# EAGLE design nabijecka (EAGLE 6.3)
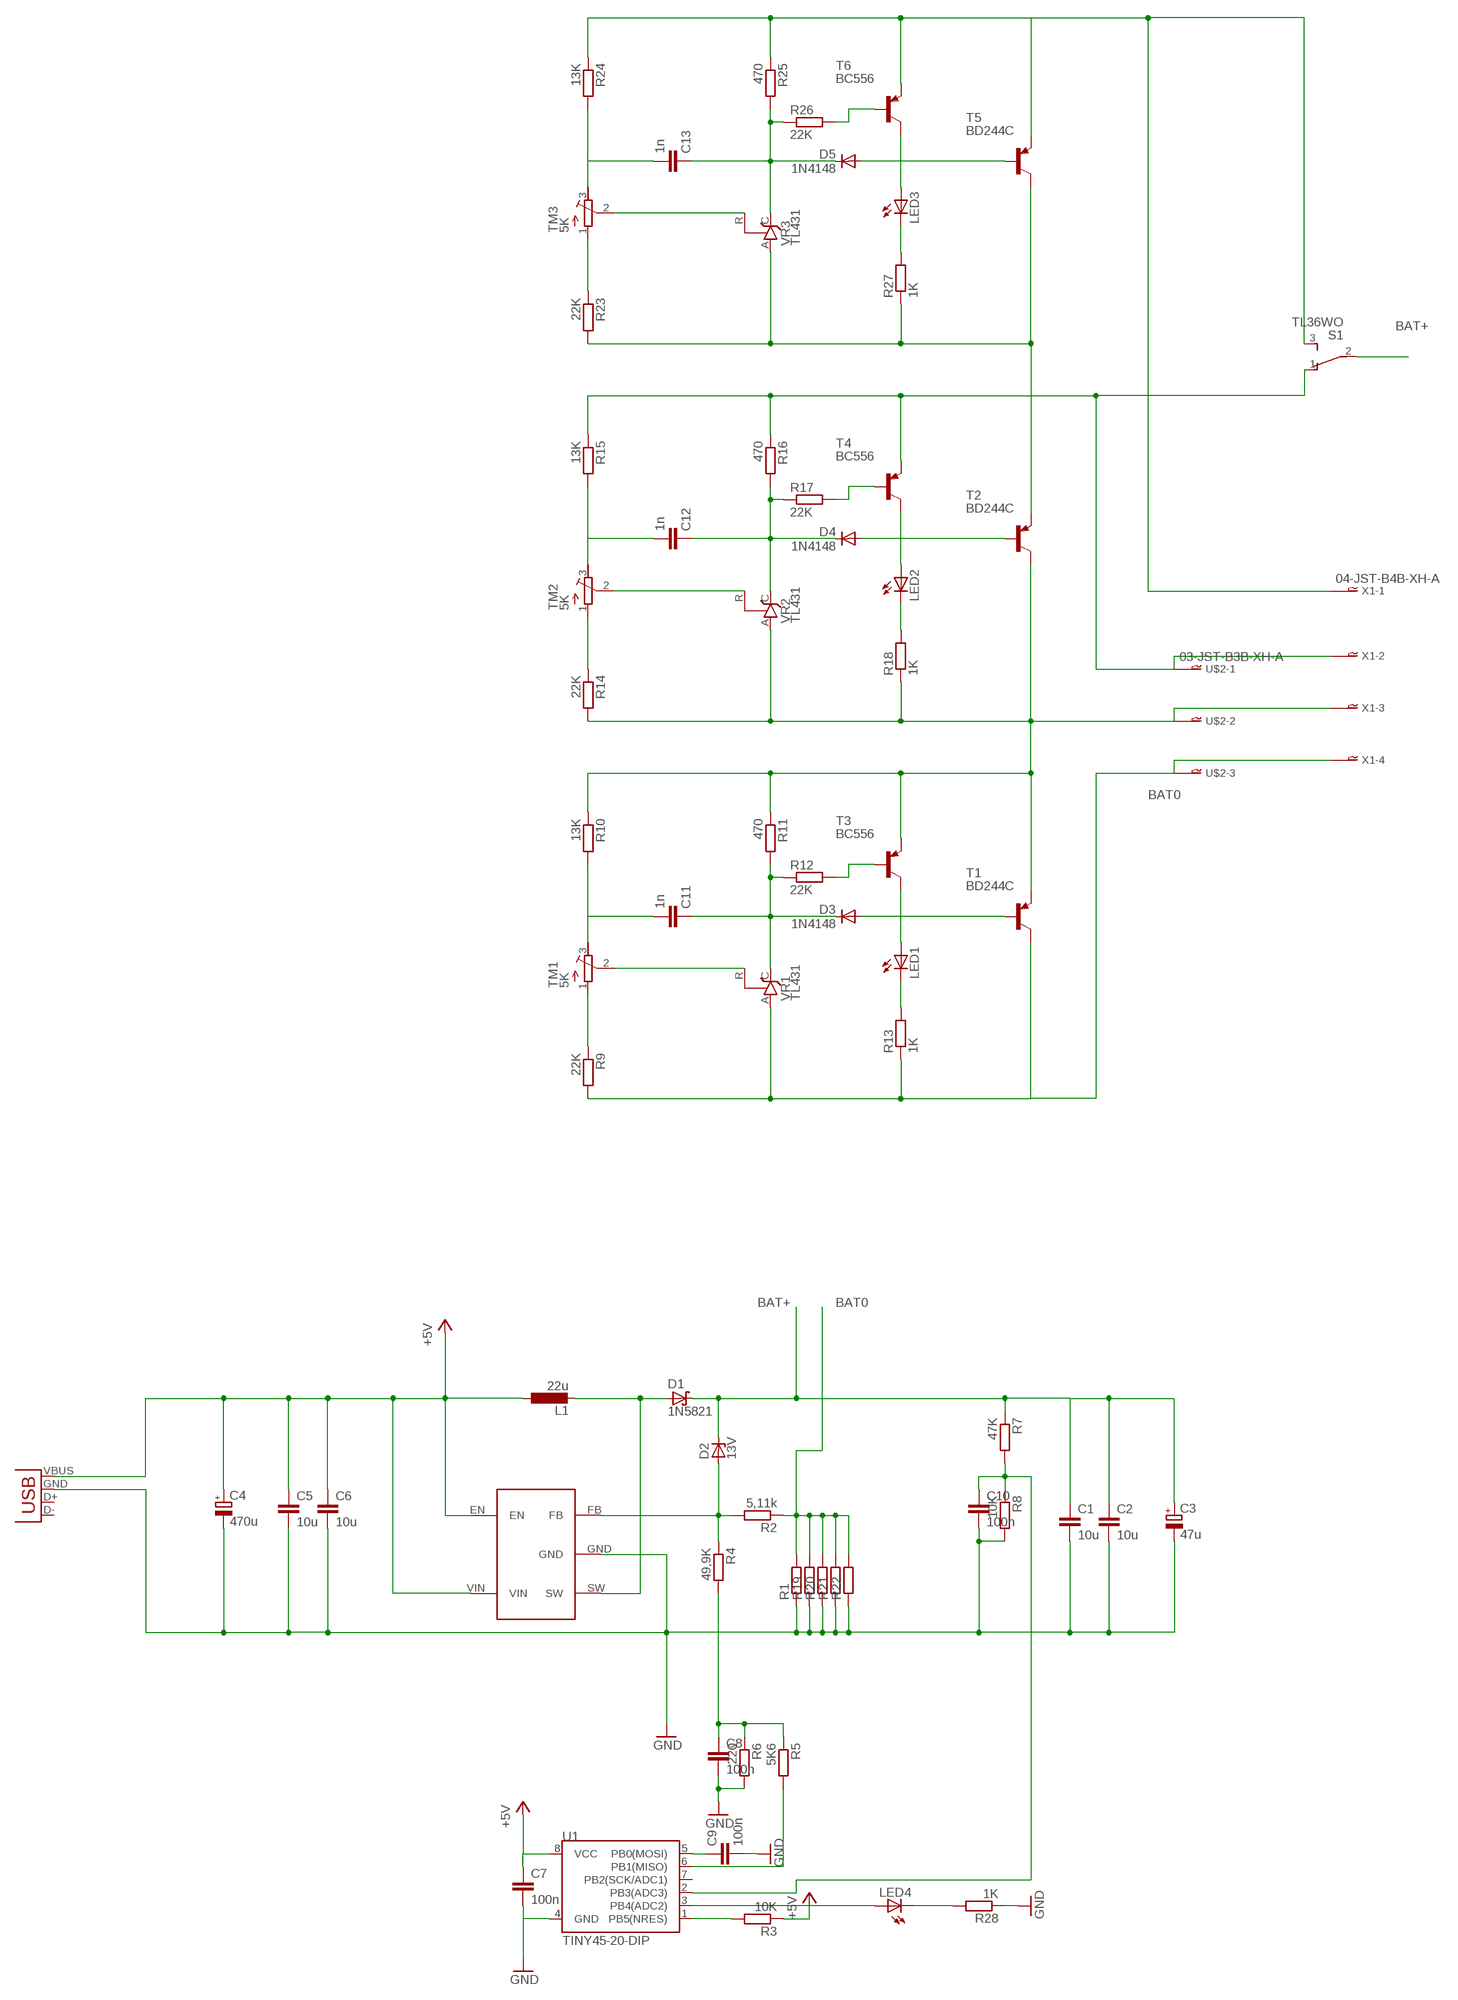
[diagram p0: schematic, sheet 1]

## Parts
C1  10u  C-EUC1206  [C1206]
C2  10u  C-EUC1206  [C1206]
C3  47u  CPOL-EUE3.5-8  [E3,5-8]
C4  470u  CPOL-EUE3.5-8  [E3,5-8]
C5  10u  C-EUC1206  [C1206]
C6  10u  C-EUC1206  [C1206]
C7  100n  C-EUC0805  [C0805]
C8  100n  C-EUC1206  [C1206]
C9  100n  C-EUC0805  [C0805]
C10  100n  C-EUC1206  [C1206]
C11  1n  C-EUC1206  [C1206]
C12  1n  C-EUC1206  [C1206]
C13  1n  C-EUC1206  [C1206]
D1  1N5821  SCHOTTKY-DIODEDO35-7  [DO35-7]
D2  13V  ZENER-DIODESOD80C  [SOD80C]
D3  1N4148  DIODE-SOD80C  [SOD80C]
D4  1N4148  DIODE-SOD80C  [SOD80C]
D5  1N4148  DIODE-SOD80C  [SOD80C]
JP2  USB-A-H  [USB-A-H]
L1  22u  L-EUWE-TPC  [POWER-CHOKE_WE-TPC]
LED1  LED3MM  [LED3MM]
LED2  LED3MM  [LED3MM]
LED3  LED3MM  [LED3MM]
LED4  LED3MM  [LED3MM]
R1  R-EU_0204/7  [0204/7]
R2  5,11k  R-EU_0204/5  [0204/5]
R3  10K  R-EU_R0805  [R0805]
R4  49,9K  R-EU_0204/5  [0204/5]
R5  5K6  R-EU_R1206  [R1206]
R6  220  R-EU_R1206  [R1206]
R7  47K  R-EU_R1206  [R1206]
R8  10K  R-EU_R1206  [R1206]
R9  22K  R-EU_R1206  [R1206]
R10  13K  R-EU_R1206  [R1206]
R11  470  R-EU_R1206  [R1206]
R12  22K  R-EU_R0805  [R0805]
R13  1K  R-EU_R1206  [R1206]
R14  22K  R-EU_R1206  [R1206]
R15  13K  R-EU_R1206  [R1206]
R16  470  R-EU_R1206  [R1206]
R17  22K  R-EU_R0805  [R0805]
R18  1K  R-EU_R1206  [R1206]
R19  R-EU_0204/7  [0204/7]
R20  R-EU_0204/7  [0204/7]
R21  R-EU_0204/7  [0204/7]
R22  R-EU_0204/7  [0204/7]
R23  22K  R-EU_R1206  [R1206]
R24  13K  R-EU_R1206  [R1206]
R25  470  R-EU_R1206  [R1206]
R26  22K  R-EU_R0805  [R0805]
R27  1K  R-EU_R1206  [R1206]
R28  1K  R-EU_R1206  [R1206]
S1  TL36WO  [TL3XWO]
T1  BD244C  -PNP-TO220  [TO220]
T2  BD244C  -PNP-TO220  [TO220]
T3  BC556  BC556B-PNP-TO92-EBC  [TO92-EBC]
T4  BC556  BC556B-PNP-TO92-EBC  [TO92-EBC]
T5  BD244C  -PNP-TO220  [TO220]
T6  BC556  BC556B-PNP-TO92-EBC  [TO92-EBC]
TM1  5K  R-TRIMM64P  [RTRIM64P]
TM2  5K  R-TRIMM64P  [RTRIM64P]
TM3  5K  R-TRIMM64P  [RTRIM64P]
U1  TINY45-20-DIP  ATTINY45TINY45-20-DIP  [DIP08]
U$1  MIC2287  [MIC2287]
U$2  03-JST-B3B-XH-A  [B3B-XH]
VR1  TL431  TL431CLP  [TO92-CLP]
VR2  TL431  TL431CLP  [TO92-CLP]
VR3  TL431  TL431CLP  [TO92-CLP]
X1  04-JST-B4B-XH-A  [B4B-XH]

## Nets
+5V: C4.+ C5.1 C6.1 C7.1 JP2.VBUS(GND) L1.1 R3.1 U1.8(VCC) U$1.EN U$1.VIN
BAT0: R1.2 R2.1 R9.2 R13.1 R19.2 R20.2 R21.2 R22.2 T1.2(C) U$2.P$3 VR1.A X1.P$4
BAT1: R10.1 R11.1 R14.2 R18.1 T1.3(E) T2.2(C) T3.E U$2.P$2 VR2.A X1.P$3
BAT2: R15.1 R16.1 R23.2 R27.1 S1.1(O) T2.3(E) T4.E T5.2(C) U$2.P$1 VR3.A X1.P$2
BAT+: C1.1 C2.1 C3.+ D1.C D2.C R7.1 S1.2(P)
GND: C1.2 C2.2 C3.- C4.- C5.2 C6.2 C7.2 C8.2 C9.2 C10.2 JP2.GND(VBUS) R1.1 R6.2 R8.2 R19.1 R20.1 R21.1 R22.1 R28.1 U1.4(GND) U$1.GND
N$1: C8.1 R4.2 R5.1 R6.1
N$2: D1.A L1.2 U$1.SW
N$3: D2.A R2.2 R4.1 U$1.FB
N$4: R3.2 U1.1(PB5(NRES))
N$5: D3.A T1.1(B)
N$6: R5.2 U1.6(PB1(MISO))
N$7: D4.A T2.1(B)
N$8: C9.1 U1.5(PB0(MOSI))
N$9: C11.1 D3.C R11.2 R12.1 VR1.C
N$10: C10.1 R7.2 R8.1 U1.2(PB3(ADC3))
N$11: D5.A T5.1(B)
N$12: C12.1 D4.C R16.2 R17.1 VR2.C
N$13: C11.2 R10.2 TM1.3(A)
N$14: TM1.2(S) VR1.R
N$15: R9.1 TM1.1(E)
N$16: LED1.K(C) R13.2
N$17: C12.2 R15.2 TM2.3(A)
N$19: LED1.A T3.C
N$20: TM2.2(S) VR2.R
N$21: R12.2 T3.B
N$22: C13.1 D5.C R25.2 R26.1 VR3.C
N$23: R14.1 TM2.1(E)
N$24: R17.2 T4.B
N$25: LED2.K(C) R18.2
N$26: LED2.A T4.C
N$27: C13.2 R24.2 TM3.3(A)
N$28: TM3.2(S) VR3.R
N$29: R23.1 TM3.1(E)
N$30: R26.2 T6.B
N$31: LED3.K(C) R27.2
N$32: LED3.A T6.C
N$33: R24.1 R25.1 S1.3(S) T5.3(E) T6.E X1.P$1
N$35: LED4.K(C) R28.2
N$36: LED4.A U1.3(PB4(ADC2))
Unconnected: JP2.D+(D-) JP2.D-(D+) U1.7(PB2(SCK/ADC1))

## Library data of the parts
C1 C2 C5-C13 = resistor:C-EU: CAPACITOR, European symbol
C3 C4 = resistor:CPOL-EU: POLARIZED CAPACITOR, European symbol
D1 = diode:SCHOTTKY-DIODE: Schottky Diode
D2 = diode:ZENER-DIODE: Z-Diode
D3-D5 = diode:DIODE-: DIODE
JP2 = SparkFun-Connectors:USB: USB Connectors USB-B-PTH is fully proven SKU : PRT-00139/CONN-08278 USB-miniB is fully proven SKU : PRT-00587 USB-A-PCB is untested. USB-A-H is throughly reviewed, but untested. Spark Fun Electronics SKU : PRT-00437 USB-B-SMT is throughly reviewed, but untested. Needs silkscreen touching up. USB-A-S has not been used/tested USB-MB-H has not been used/tested USB-MICROB has been used. CONN-09505
L1 = rcl:L-EU: INDUCTOR, European symbol
LED1-LED4 = led:LED: LED OSRAM: - CHIPLED LG R971, LG N971, LY N971, LG Q971, LY Q971, LO R971, LY R971 LH N974, LH R974 LS Q976, LO Q976, LY Q976 LO Q996 - Hyper CHIPLED LW Q18S LB Q993, LB Q99A, LB R99A - SideLED LS A670, LO A670, LY A670, LG A670, LP A670 LB A673, LV A673, LT A673, LW A673 LH A674 LY A675 LS A676, LA A676, LO A676, LY A676, LW A676 LS A679, LY A679, LG A679 - Hyper Micro SIDELED® LS Y876, LA Y876, LO Y876, LY Y876 LT Y87S - SmartLED LW L88C, LW L88S LB L89C, LB L89S, LG L890 LS L89K, LO L89K, LY L89K LS L896, LA L896, LO L896, LY L896 - TOPLED LS T670, LO T670, LY T670, LG T670, LP T670 LSG T670, LSP T670, LSY T670, LOP T670, LYG T670 LG T671, LOG T671, LSG T671 LB T673, LV T673, LT T673, LW T673 LH T674 LS T676, LA T676, LO T676, LY T676, LB T676, LH T676, LSB T676, LW T676 LB T67C, LV T67C, LT T67C, LS T67K, LO T67K, LY T67K, LW E67C LS E67B, LA E67B, LO E67B, LY E67B, LB E67C, LV E67C, LT E67C LW T67C LS T679, LY T679, LG T679 LS T770, LO T770, LY T770, LG T770, LP T770 LB T773, LV T773, LT T773, LW T773 LH T774 LS E675, LA E675, LY E675, LS T675 LS T776, LA T776, LO T776, LY T776, LB T776 LHGB T686 LT T68C, LB T68C - Hyper Mini TOPLED® LB M676 - Mini TOPLED Santana® LG M470 LS M47K, LO M47K, LY M47K Source: http://www.osram.convergy.de LUXEON: - LUMILED® LXK2-PW12-R00, LXK2-PW12-S00, LXK2-PW14-U00, LXK2-PW14-V00 LXK2-PM12-R00, LXK2-PM12-S00, LXK2-PM14-U00 LXK2-PE12-Q00, LXK2-PE12-R00, LXK2-PE12-S00, LXK2-PE14-T00, LXK2-PE14-U00 LXK2-PB12-K00, LXK2-PB12-L00, LXK2-PB12-M00, LXK2-PB14-N00, LXK2-PB14-P00, LXK2-PB14-Q00 LXK2-PR12-L00, LXK2-PR12-M00, LXK2-PR14-Q00, LXK2-PR14-R00 LXK2-PD12-Q00, LXK2-PD12-R00, LXK2-PD12-S00 LXK2-PH12-R00, LXK2-PH12-S00 LXK2-PL12-P00, LXK2-PL12-Q00, LXK2-PL12-R00 Source: www.luxeon.com KINGBRIGHT: KA-3528ASYC Source: www.kingbright.com
R1-R28 = resistor:R-EU_: RESISTOR, European symbol
S1 = switch:TL36WO: TINY SWITCH ON - ON Source: http://www2.produktinfo.conrad.com/datenblaetter/700000-724999/705152-da-01-de-Subminiaturschalter_TL_36WO.pdf
T1-T6 = transistor:*-PNP-: PNP Transistror
TM1-TM3 = resistor:R-TRIMM: Trimm resistor
U1 = SparkFun-DigitalIC:ATTINY45: Atmel 8-pin 2/4/8kB flash uC; PROD_ID: IC-09439
U$1 = mic2287:MIC2287
U$2 = con-jst-xh:03-JST: JST CONNECTOR
VR1-VR3 = v-reg:TL431CLP: VOLTAGE REGULATOR
X1 = con-jst-xh:04-JST: JST CONNECTOR

## Board
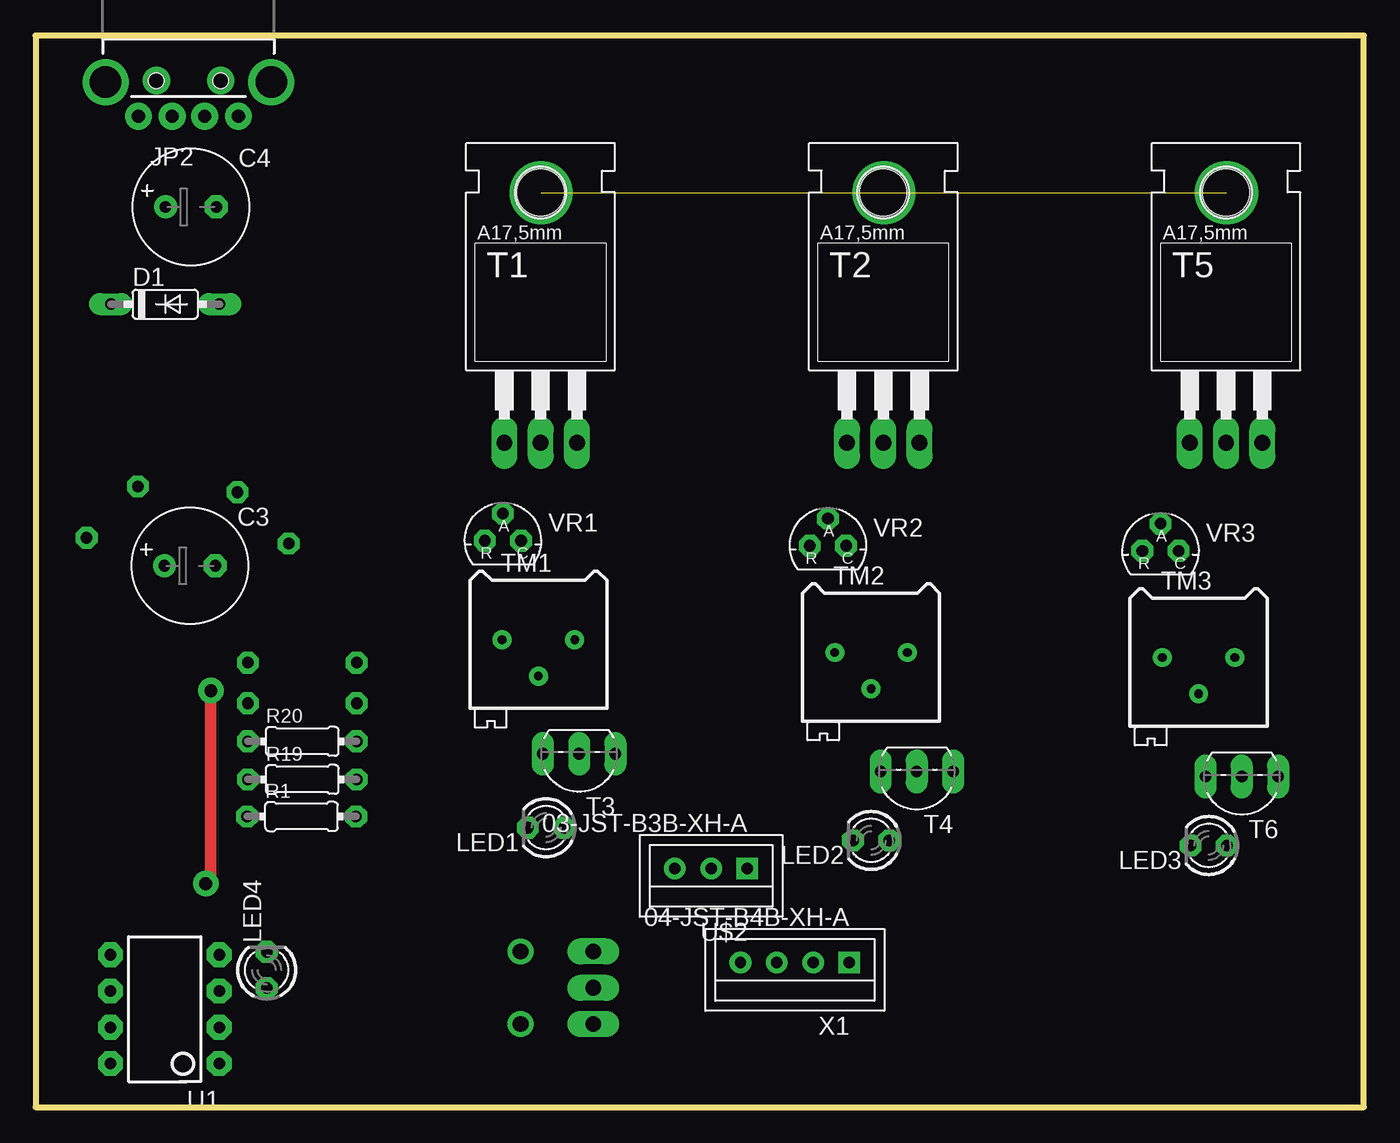
[diagram p1: board, top side]
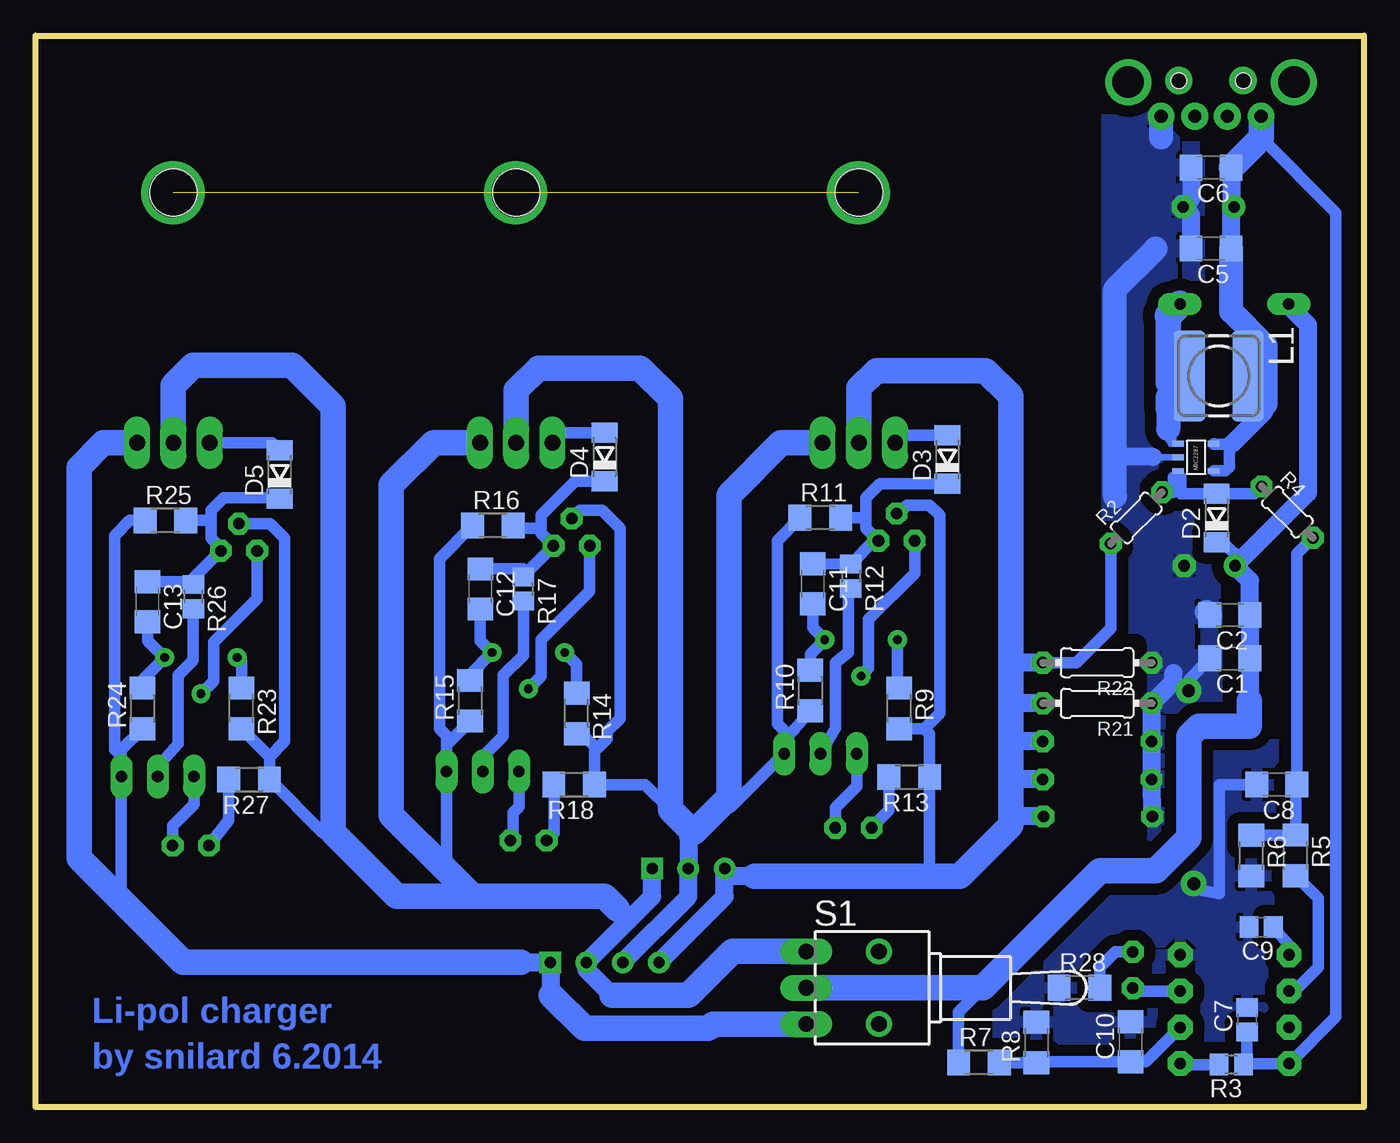
[diagram p2: board, bottom side, seen from below]

Size 93 x 75 mm. Coordinates in mm from the lower left corner, seen from the top.
Outline: 0,0 93,0 93,75 0,75 0,0
Copper layers (1*16): Top 0.035mm / dielectric 1.5mm / Bottom 0.035mm
Design rules "default *": minimum track width 16mil, minimum drill 24mil, track to track 16mil, track to pad 16mil, pad to pad 16mil, via to via 16mil, smd to smd 16mil, copper to edge 40mil, drill to drill 8mil, minimum pad ring 14mil, minimum via ring 16mil, stop-mask expansion 40mil, vias tented up to drill 0mil, thermal gap 10mil
bRestrict: area 16,18.8 to 18.5,32.4

### Footprints (pad centres in the part's own frame; a part is rotated, then mirrored left to right if it is on the bottom)
C1206 = smd 1.6 x 1.8: 1 -1.4,0; 2 1.4,0
E3,5-8 = drill 0.813 pad 1.6: + -1.778,0 | drill 0.813 pad 1.6 octagon: - 1.778,0
C0805 = smd 1.3 x 1.5: 1 -0.85,0; 2 0.85,0
DO35-7 = drill 0.813 long: A 3.81,0; C -3.81,0
SOD80C = smd 1.4 x 1.8: A 1.7,0; C -1.7,0
USB-A-H = drill 0.914 pad 1.88: D+ 2.4,1.127; D- 2.4,-1.127; GND 2.4,3.5; VBUS 2.4,-3.5 | drill 2.2: GND2 0,-5.8; GND3 0,5.8 | hole 1.1: -0.1,2.25; -0.1,-2.25
POWER-CHOKE_WE-TPC = smd 6.3 x 2.2: 1 0,2.05; 2 0,-2.05
LED3MM = drill 0.813 octagon: A -1.27,0; K 1.27,0
0204/7 = drill 0.813 octagon: 1 -3.81,0; 2 3.81,0
0204/5 = drill 0.813 octagon: 1 -2.54,0; 2 2.54,0
R0805 = smd 1.3 x 1.5: 1 -0.85,0; 2 0.85,0
R1206 = smd 1.6 x 1.803: 1 -1.422,0; 2 1.422,0
TL3XWO = drill 1.1 pad 1.422 long: 1 -2.54,-5.08; 2 0,-5.08; 3 2.54,-5.08 | drill 1.1 pad 1.676: M1 -2.54,0; M2 2.54,0
TO220 = drill 1.118 long: 1 -2.54,-6.35; 2 0,-6.35; 3 2.54,-6.35 | hole 3.302: 0,11.176
TO92-EBC = drill 0.813 long: B 0,-1.27; C 2.54,-1.27; E -2.54,-1.27
RTRIM64P = drill 0.61: 1 0,-2.54; 2 2.54,0; 3 0,2.54
DIP08 = drill 0.813 pad 1.727 octagon: 1 -3.81,-3.81; 2 -1.27,-3.81; 3 1.27,-3.81; 4 3.81,-3.81; 5 3.81,3.81; 6 1.27,3.81; 7 -1.27,3.81; 8 -3.81,3.81
MIC2287 = smd 0.4 x 0.8: EN -0.7,-1.98; FB -0.7,0.5; GND 0.25,0.5; SW 1.2,0.5; VIN 1.2,-1.98
B3B-XH = drill 0.8 square: P$1 -2.54,0 | drill 0.8: P$2 0,0; P$3 2.54,0
TO92-CLP = drill 0.813 octagon: A 0,1.905; C 1.27,0; R -1.27,0
B4B-XH = drill 0.8 square: P$1 -3.81,0 | drill 0.8: P$2 -1.27,0; P$3 1.27,0; P$4 3.81,0

### Placement (x,y rotation side)
C1  9.37,31.42 180 bottom
C2  9.37,34.44 180 bottom
C3  10.79,37.9 0 top
C4  10.87,63.02 0 top
C5  10.69,60.1 180 bottom
C6  10.69,65.76 180 bottom
C7  8.18,6.12 90 bottom
C8  6.1,22.58 180 bottom
C9  7.19,12.6 180 bottom
C10  16.33,4.57 90 bottom
C11  38.58,36.63 270 bottom
C12  61.87,36.27 270 bottom
C13  85.17,35.38 270 bottom
D1  9.07,56.21 0 top
D2  10.31,41.25 90 bottom
D3  29.16,45.34 90 bottom
D4  53.16,45.52 90 bottom
D5  75.92,44.27 90 bottom
JP2  10.69,71.75 270 top
L1  10.16,51.18 270 bottom
LED1  35.74,19.56 180 top
LED2  58.5,18.67 180 top
LED3  82.14,18.31 180 top
LED4  16.18,9.6 90 top
R1  18.62,20.35 0 top
R2  15.93,41.25 45 bottom
R3  9.27,2.97 180 bottom
R4  5.36,41.66 315 bottom
R5  4.78,17.63 270 bottom
R6  7.87,17.6 270 bottom
R7  26.95,3.12 0 bottom
R8  22.94,4.52 90 bottom
R9  32.54,27.91 270 bottom
R10  38.76,29.16 90 bottom
R11  38.05,41.25 0 bottom
R12  35.92,37.16 270 bottom
R13  31.83,23.11 180 bottom
R14  55.12,27.56 270 bottom
R15  62.59,28.45 90 bottom
R16  60.99,40.72 0 bottom
R17  58.85,36.27 270 bottom
R18  55.3,22.58 180 bottom
R19  18.67,22.94 0 top
R20  18.67,25.6 0 top
R21  18.67,28.27 180 bottom
R22  18.67,31.11 180 bottom
R23  78.59,27.91 270 bottom
R24  85.52,27.91 90 bottom
R25  83.92,41.07 0 bottom
R26  81.97,35.74 270 bottom
R27  78.05,22.94 180 bottom
R28  19.91,8.36 0 bottom
S1  33.96,8.36 270 bottom
T1  35.36,52.85 0 top
T2  59.36,52.85 0 top
T3  38.05,23.47 180 top
T4  61.7,22.23 180 top
T5  83.36,52.85 0 top
T6  84.45,21.87 180 top
TM1  35.2,32.72 270 top
TM2  58.5,31.83 270 top
TM3  81.43,31.47 270 top
U1  9.04,6.86 90 top
U$1  12.5,45.24 90 bottom
U$2  47.29,16.71 180 top
VR1  32.72,39.65 0 top
VR2  55.47,39.29 0 top
VR3  78.77,38.94 0 top
X1  53.16,10.13 180 top

### Tracks (layer width: path | path; a pad name or v marks a point on that pad's centre or on a via)
+5V
  Bottom 0.813: 7.19,67.86 1.96,62.62 1.96,6.33 U1.8 7.77,3.05 R3.1 8.18,3.21 C7.1 | U$1.VIN 10.48,46.41 9.25,46.41 9.42,46.23 9.42,44.81 9.69,44.54 U$1.EN
  Bottom 1.27: C6.1 9.29,63.22 C4.+ 9.29,62.82 C5.1 | 6.93,49.25 6.93,48.72 9.25,46.41 | L1.1 7.44,51.18 6.93,50.67
  Bottom 1.676: 6.93,53.34 9.29,55.7 C5.1
  Bottom 1.778: JP2.VBUS 7.19,67.86 C6.1 | 6.93,49.25 6.93,50.67 6.93,53.34
BAT0
  Bottom 0.813: VR1.A 32.59,41.55 32,42.14 30.4,42.14 29.69,41.43 29.69,27.56 30.76,26.49 | 30.76,26.49 R9.2 | 30.76,26.49 30.4,26.14 R13.1 30.4,16.71 30.94,16.18 | R2.1 17.72,33.53 20.14,31.11 R22.2
  Bottom 1.27: X1.P$4 44.76,14.73 44.76,16.18 | 44.76,16.18 U$2.P$3 | 42.67,16.18 44.76,16.18 | R22.2 24.71,31.11 | R21.2 24.54,28.27 24.71,28.45 | R20.2 24.54,25.6 24.71,25.43 | R19.2 24.71,22.94 | R1.2 24.64,20.34 24.71,20.27
  Bottom 1.778: T1.2 35.36,50.34 34.14,51.56 26.49,51.56 24.71,49.78 24.71,31.11 24.71,28.45 24.71,25.43 24.71,22.94 24.71,20.27 24.71,19.74 28.27,16.18 30.94,16.18 42.67,16.18
BAT1
  Bottom 0.813: 40.27,26.05 40.59,25.73 T3.E 44.35,20.98 45.16,20.98 | 40.27,26.05 39.83,26.49 R10.1 | R11.1 41.07,39.65 41.07,26.85 40.27,26.05 | VR2.A 54.89,41.78 53.34,41.78 52.09,40.54 52.09,27.2 52.98,26.31 52.98,25.78 53.7,25.07 | 54.94,26.31 R14.2 54.76,26.14 53.7,25.07 | 53.7,25.07 53.87,24.89 R18.1 50.32,22.58 48.54,20.8
  Bottom 1.27: X1.P$3 47.3,14.73 U$2.P$2 47.3,18.85 46.94,19.2
  Bottom 1.778: T1.3 40.8,46.5 44.45,42.85 44.45,21.69 45.16,20.98 46.94,19.2 48.54,20.8 48.54,49.61 50.67,51.74 57.78,51.74 59.36,50.17 T2.2
BAT2
  Bottom 0.813: R15.1 64.24,25.38 | 64.24,25.38 T4.E 64.24,16.59 64.1,16.45 | R16.1 64.72,38.4 64.72,26.49 64.24,26.01 64.24,25.38 | R23.2 76.63,24.54 | 76.63,24.54 R27.1 72.9,19.2 72.19,19.2 | VR3.A 76.58,40.84 75.56,39.83 75.56,25.6 76.63,24.54
  Bottom 1.27: 52.63,7.82 54.43,9.63 X1.P$2 51.49,13.08 | 51.49,13.08 49.84,14.73 U$2.P$1 | 52.27,13.87 51.49,13.08
  Bottom 1.778: S1.1 44.22,10.9 47.3,7.82 52.63,7.82 | T2.3 65.16,46.5 68.1,43.56 68.1,20.45 64.1,16.45 62.41,14.76 | 62.41,14.76 53.16,14.76 52.27,13.87 | T5.2 83.36,50.53 81.97,51.92 75.03,51.92 72.19,49.07 72.19,19.2 67.74,14.76 62.41,14.76
BAT+
  Bottom 0.813: D2.C 9.86,39.55 8.61,38.3 | R7.1 28.37,6.66 26.67,8.36
  Bottom 1.27: 8,28.45 7.97,28.48 C1.1 C2.1 7.97,36.85 C3.+ 8.61,38.3 3.91,43 3.91,54.76 5.26,56.11 D1.C
  Bottom 1.778: 8,28.45 8,26.67 11.56,26.67 12.27,25.96 12.27,18.85 14.58,16.54 18.49,16.54 26.67,8.36 S1.2
GND  (via drill 0.9 pad 1.78)
  Top 0.813: v11.91,15.65 12.27,16 v12.27,29.16
  Bottom 0.457: U$1.GND 14.73,45.49 14.76,45.52
  Bottom 0.813: C8.2 10.13,22.58 10.13,14.94 11.91,15.29 v11.91,15.65 | v12.27,29.16 12.27,29.92 C1.2
  Bottom 1.27: C6.2 12.09,63.57 C4.- 12.09,62.46 C5.2 | 14.76,45.52 17.25,45.52 17.42,45.7 | R1.1 14.83,22.89 R19.1 R20.1 R21.1 13.34,29.79 13.34,30.4
  Bottom 1.676: C2.2 11,34.67 | 17.42,42.75 17.42,45.7 17.42,57.25 14.58,60.1 | 14.19,67.86 JP2.GND
  pour Bottom (isolate 0.813): 12.09,26.49 8,26.85 1.78,26.85 1.78,1.6 25.6,1.6 25.6,9.78 19.02,15.82 14.4,16.71 12.62,22.58
  pour Bottom (isolate 0.813): 17.78,69.52 17.78,18.14 10.49,18.14 10.49,43.03 14.58,43.03 14.58,56.36 11.73,56.36 11.73,69.52
N$1
  Bottom 0.813: R6.1 7.85,19.05 R5.1 4.78,22.32 C8.1 4.7,38.73 R4.2
N$2
  Bottom 0.406: 13.51,46.76 13.51,46.44 U$1.SW | 13.69,49.7 13.69,50.45 13.47,50.45
  Bottom 0.813: 13.69,47.47 13.51,47.3 13.51,46.76
  Bottom 1.27: 13.69,50.67 13.47,50.45 13.47,49.92
  Bottom 1.676: 13.69,48.9 13.69,47.47
  Bottom 1.778: 13.69,49.7 13.69,48.9 | 13.69,55.4 13.69,50.67
  Bottom 1.93: L1.2 13.47,49.92 | D1.A 13.69,55.4
N$3
  Bottom 0.406: U$1.FB 12.8,44.54 12.8,44.09 13.34,44.09
  Bottom 0.813: R4.1 7.66,42.95 D2.A 12.8,42.95 12.8,44.09 | R2.2 13.34,43.05 13.34,44.09
N$4
  Bottom 0.813: R3.2 12.78,2.97 U1.1
N$5
  Bottom 0.813: 28.9,46.94 D3.A 32.28,47.04 T1.1
N$6
  Bottom 0.813: U1.6 5.18,8.18 4.8,8.18 3.2,9.78 3.2,14.63 R5.2
N$7
  Bottom 0.813: T2.1 56.1,47.22 D4.A
N$8
  Bottom 0.813: U1.5 5.23,11.33 C9.1
N$9
  Bottom 0.813: 38.38,38.05 C11.1 38.56,38.05 R12.1 34.31,39.65 VR1.C 34.85,40.51 34.85,41.25 | 34.85,41.25 34.85,42.67 33.88,43.64 D3.C | R11.2 34.85,41.25
N$10
  Bottom 0.813: R7.2 25.5,3.1 R8.1 22.86,3.17 C10.1 15.27,3.17 U1.2
N$11
  Bottom 0.813: T5.1 76.45,46.5 D5.A
N$12
  Bottom 0.813: 57.61,40.54 57.61,40.16 VR2.C 58.34,37.69 R17.1 58.87,37.67 C12.1 | 57.61,40.54 57.61,41.43 55.22,43.82 D4.C | R16.2 59.39,40.54 57.61,40.54
N$13
  Bottom 0.813: C11.2 38.58,33.55 TM1.3 38.76,31.7 R10.2
N$14
  Bottom 0.813: TM1.2 34.67,30.71 34.67,34.14 31.45,37.36 VR1.R
N$15
  Bottom 0.813: TM1.1 32.66,29.46 R9.1
N$16
  Bottom 0.813: LED1.K 33.25,20.78 R13.2
N$17
  Bottom 0.813: C12.2 61.87,32.66 TM2.3 62.59,30.28 R15.2
N$18  (via drill 1.1)
  other vias: 12.95,71.86
N$19
  Bottom 0.813: T3.C 35.51,22.45 37.01,20.95 LED1.A
N$20
  Bottom 0.813: VR2.R 54.2,36.12 57.61,32.72 57.61,30.18 TM2.2
N$21
  Bottom 0.813: T3.B 36.98,26.52 36.98,31.11 36.09,31.83 36.09,35.92 R12.2
N$22
  Bottom 0.813: C13.1 82.16,36.78 R26.1 81.97,37.01 VR3.C 80.03,39.14 80.72,39.83 80.72,40.89 | 80.72,40.89 80.72,41.78 79.83,42.67 76.02,42.67 D5.C | R25.2 80.9,41.07 80.72,40.89
N$23
  Bottom 0.813: R14.1 55.12,30.99 TM2.1
N$24
  Bottom 0.813: T4.B 61.7,24.54 60.27,25.96 60.27,30.23 58.85,31.65 R17.2
N$25
  Bottom 0.813: LED2.K 56.72,19.18 R18.2
N$26
  Bottom 0.813: T4.C 59.16,21.03 59.56,20.62 59.56,18.87 LED2.A
N$27
  Bottom 0.813: R24.2 85.52,29.92 TM3.3 85.17,32.66 C13.2
N$28
  Bottom 0.813: VR3.R 77.5,35.59 80.54,32.54 80.54,29.82 TM3.2
N$29
  Bottom 0.813: R23.1 78.59,31.17 TM3.1
N$30
  Bottom 0.813: T6.B 84.45,23.82 83.03,25.43 83.03,30.23 81.97,31.29 R26.2
N$31
  Bottom 0.813: LED3.K 79.48,20.07 R27.2
N$32
  Bottom 0.813: T6.C 81.92,21.21 83.41,19.71 LED3.A
N$33
  Bottom 0.813: R24.1 87,25.02 87,24.54 | 87,24.54 T6.E 87,14.45 86.94,14.4 | R25.1 86.41,41.07 87.48,40.01 87.48,25.02 87,24.54
  Bottom 1.27: 56.9,7.82 56.9,10.06 X1.P$1 59.03,10.13
  Bottom 1.778: S1.3 45.57,5.82 45.87,5.51 54.59,5.51 56.9,7.82 | T5.3 88.27,46.5 89.97,44.81 89.97,17.42 86.94,14.4 82.68,10.13 59.03,10.13
N$34  (via drill 1.1)
  other vias: 8.46,71.86
N$35
  Bottom 0.813: LED4.K 17.4,10.87 18.49,9.78 R28.2
N$36
  Bottom 0.813: U1.3 15.98,8.13 LED4.A
N$37  (via drill 3.4)  (2 unrouted)
  other vias: 35.38,64.01 59.39,64.01 83.39,64.01

### Text on the board
Bottom: Li-pol charger | by snilard 6.2014